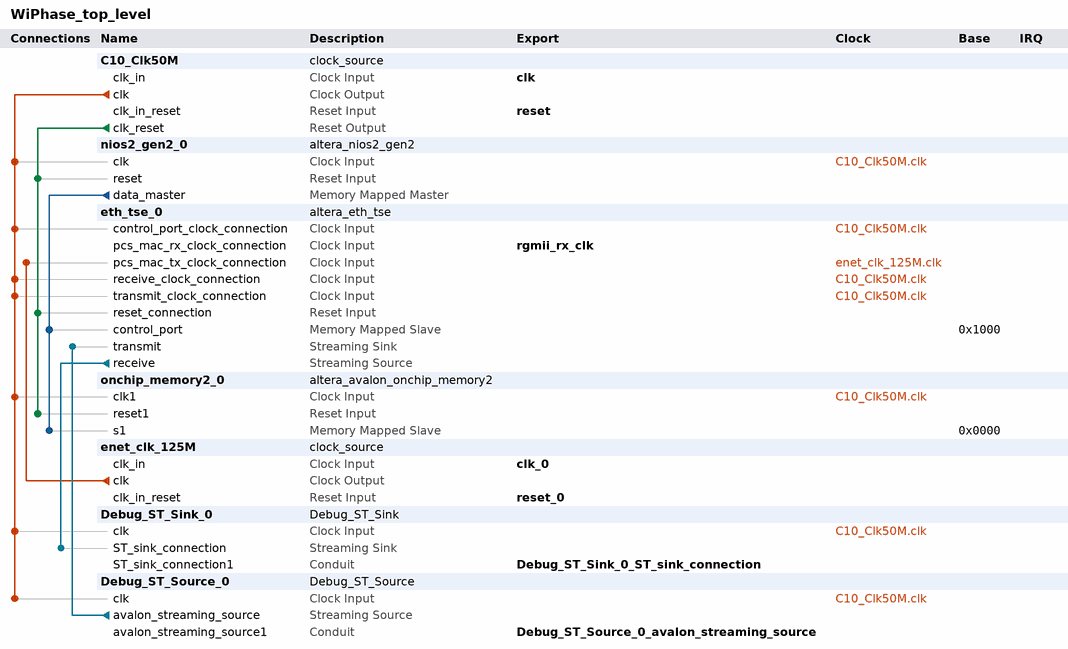
[diagram p0: system contents]
# Platform Designer (Qsys) system WiPhase_top_level, Cyclone 10 LP 10CL025YU256C8G
# Parameters at their usual value, and those the tool derives, are not listed.
package require -exact qsys 17.1
create_system WiPhase_top_level
set_project_property DEVICE_FAMILY {Cyclone 10 LP}
set_project_property DEVICE 10CL025YU256C8G

add_instance C10_Clk50M clock_source 17.1
set_instance_parameter_value C10_Clk50M clockFrequency 50000000

add_instance nios2_gen2_0 altera_nios2_gen2 17.1
set_instance_parameter_value nios2_gen2_0 dcache_size 2048
set_instance_parameter_value nios2_gen2_0 debug_enabled false
set_instance_parameter_value nios2_gen2_0 exceptionSlave Absolute
set_instance_parameter_value nios2_gen2_0 icache_size 4096
set_instance_parameter_value nios2_gen2_0 impl Tiny
set_instance_parameter_value nios2_gen2_0 resetSlave Absolute

add_instance eth_tse_0 altera_eth_tse 17.1
set_instance_parameter_value eth_tse_0 XCVR_RCFG_JTAG_ENABLE 0
set_instance_parameter_value eth_tse_0 XCVR_SET_CAPABILITY_REG_ENABLE 0
set_instance_parameter_value eth_tse_0 XCVR_SET_CSR_SOFT_LOGIC_ENABLE 0
set_instance_parameter_value eth_tse_0 XCVR_SET_PRBS_SOFT_LOGIC_ENABLE 0
set_instance_parameter_value eth_tse_0 XCVR_SET_USER_IDENTIFIER 0
set_instance_parameter_value eth_tse_0 core_variation MAC_ONLY
set_instance_parameter_value eth_tse_0 enable_hd_logic true
set_instance_parameter_value eth_tse_0 enable_mac_flow_ctrl true
set_instance_parameter_value eth_tse_0 enable_magic_detect true
set_instance_parameter_value eth_tse_0 enable_shift16 true
set_instance_parameter_value eth_tse_0 ext_stat_cnt_ena true
set_instance_parameter_value eth_tse_0 ifGMII RGMII
set_instance_parameter_value eth_tse_0 ing_addr 11
set_instance_parameter_value eth_tse_0 mdio_clk_div 40
set_instance_parameter_value eth_tse_0 stat_cnt_ena true
set_instance_parameter_value eth_tse_0 transceiver_type NONE

add_instance onchip_memory2_0 altera_avalon_onchip_memory2 17.1
set_instance_parameter_value onchip_memory2_0 dataWidth 32
set_instance_parameter_value onchip_memory2_0 dualPort false
set_instance_parameter_value onchip_memory2_0 initMemContent true
set_instance_parameter_value onchip_memory2_0 initializationFileName onchip_mem.hex
set_instance_parameter_value onchip_memory2_0 memorySize 4096

add_instance enet_clk_125M clock_source 17.1
set_instance_parameter_value enet_clk_125M clockFrequency 125000000

add_instance Debug_ST_Sink_0 Debug_ST_Sink 1.0

add_instance Debug_ST_Source_0 Debug_ST_Source 1.0

# connections
add_connection C10_Clk50M.clk Debug_ST_Sink_0.clk clock
add_connection C10_Clk50M.clk Debug_ST_Source_0.clk clock
add_connection C10_Clk50M.clk eth_tse_0.control_port_clock_connection clock
add_connection C10_Clk50M.clk eth_tse_0.receive_clock_connection clock
add_connection C10_Clk50M.clk eth_tse_0.transmit_clock_connection clock
add_connection C10_Clk50M.clk nios2_gen2_0.clk clock
add_connection C10_Clk50M.clk onchip_memory2_0.clk1 clock
add_connection enet_clk_125M.clk eth_tse_0.pcs_mac_tx_clock_connection clock
add_connection C10_Clk50M.clk_reset eth_tse_0.reset_connection reset
add_connection C10_Clk50M.clk_reset nios2_gen2_0.reset reset
add_connection C10_Clk50M.clk_reset onchip_memory2_0.reset1 reset
add_connection nios2_gen2_0.data_master eth_tse_0.control_port avalon
set_connection_parameter_value nios2_gen2_0.data_master/eth_tse_0.control_port baseAddress 0x1000
add_connection nios2_gen2_0.data_master onchip_memory2_0.s1 avalon
set_connection_parameter_value nios2_gen2_0.data_master/onchip_memory2_0.s1 baseAddress 0x0000
add_connection Debug_ST_Source_0.avalon_streaming_source eth_tse_0.transmit avalon_streaming
add_connection eth_tse_0.receive Debug_ST_Sink_0.ST_sink_connection avalon_streaming

# exported interfaces
add_interface Debug_ST_Sink_0_ST_sink_connection conduit end
set_interface_property Debug_ST_Sink_0_ST_sink_connection EXPORT_OF Debug_ST_Sink_0.ST_sink_connection1
add_interface Debug_ST_Source_0_avalon_streaming_source conduit end
set_interface_property Debug_ST_Source_0_avalon_streaming_source EXPORT_OF Debug_ST_Source_0.avalon_streaming_source1
add_interface clk clock sink
set_interface_property clk EXPORT_OF C10_Clk50M.clk_in
add_interface clk_0 clock sink
set_interface_property clk_0 EXPORT_OF enet_clk_125M.clk_in
add_interface reset reset sink
set_interface_property reset EXPORT_OF C10_Clk50M.clk_in_reset
add_interface reset_0 reset sink
set_interface_property reset_0 EXPORT_OF enet_clk_125M.clk_in_reset
add_interface rgmii_rx_clk clock sink
set_interface_property rgmii_rx_clk EXPORT_OF eth_tse_0.pcs_mac_rx_clock_connection

set_interconnect_requirement {$system} qsys_mm.clockCrossingAdapter HANDSHAKE
set_interconnect_requirement {$system} qsys_mm.enableEccProtection FALSE
set_interconnect_requirement {$system} qsys_mm.insertDefaultSlave FALSE
set_interconnect_requirement {$system} qsys_mm.maxAdditionalLatency 1

save_system WiPhase_top_level.qsys
